# Altium project Workshop_Project.PrjPcb
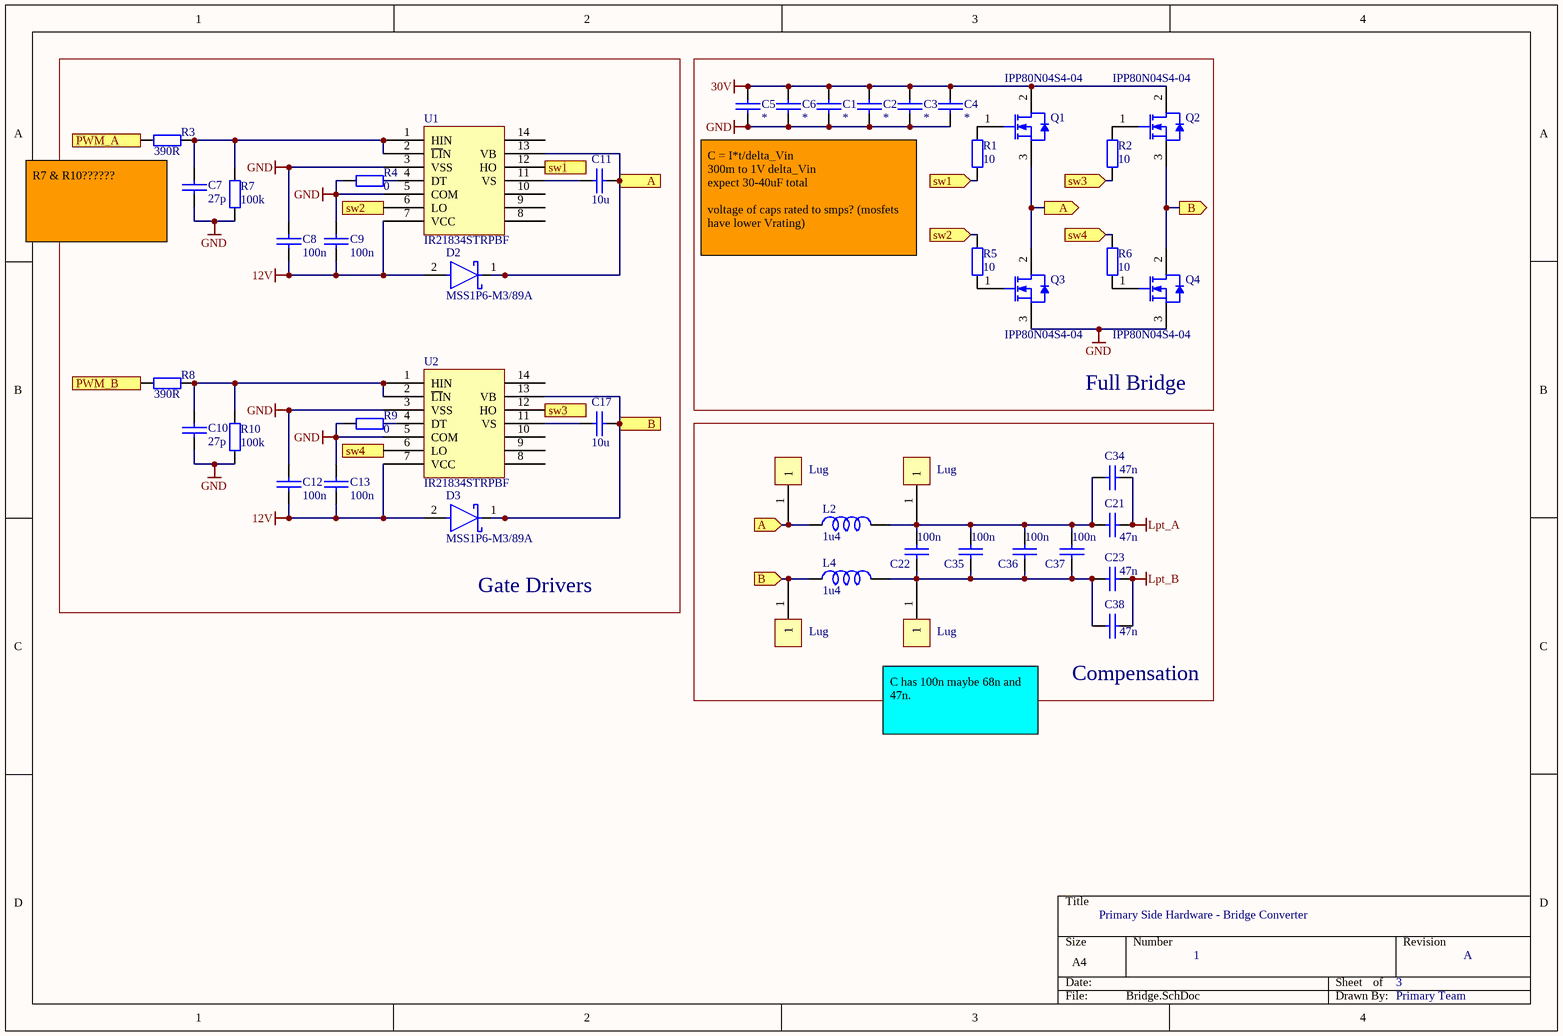
[diagram p0: Bridge.SchDoc]
HEllo: 5
3 sheets, 106 parts. Net scope: flat (ports and power ports of the same name join across sheets).
Board file: PCB.PcbDoc
Sheets:
  Bridge.SchDoc
  Control.SchDoc
  Misc.SchDoc

## Sheet Bridge.SchDoc: Primary Side Hardware - Bridge Converter
size A4; Author: Suzanne Lo; Revision: A; SheetNumber: 1; SheetTotal: 3

### Parts
C1  *  [C1210]
C2  *  [C1210]
C3  *  [C1210]
C4  *  [C1210]
C5  *  [C1210]
C6  *  [C1210]
C7  27p  [C0805]
C8  100n  [C1210]
C9  100n  [C1210]
C10  27p  [C0805]
C11  10u  [C1210]
C12  100n  [C1210]
C13  100n  [C1210]
C17  10u  [C1210]
C21  47n  [C5750]
C22  100n  [C5750]
C23  47n  [C5750]
C34  47n  [C5750]
C35  100n  [C5750]
C36  100n  [C5750]
C37  100n  [C5750]
C38  47n  [C5750]
D2  MSS1P6-M3/89A  [FP-96591-MFG]
D3  MSS1P6-M3/89A  [FP-96591-MFG]
L2  1u4  [EFD20]
L4  1u4  [EFD20]
P6  Lug  [M3 Lug]
P7  Lug  [M3 Lug]
P8  Lug  [M3 Lug]
P9  Lug  [M3 Lug]
Q1  IPP80N04S4-04  [INF-PG-TO220-3-1]
Q2  IPP80N04S4-04  [INF-PG-TO220-3-1]
Q3  IPP80N04S4-04  [INF-PG-TO220-3-1]
Q4  IPP80N04S4-04  [INF-PG-TO220-3-1]
R1  10  [R1206]
R2  10  [R1206]
R3  390R  [R0805]
R4  0  [R0805]
R5  10  [R1206]
R6  10  [R1206]
R7  100k  [R0805]
R8  390R  [R0805]
R9  0  [R0805]
R10  100k  [R0805]
U1  IR21834STRPBF  [SOIC127P600X175-14N]
U2  IR21834STRPBF  [SOIC127P600X175-14N]

### Blocks framed on the sheet
Gate Drivers: C7-C13 C17 D2 D3 R3 R4 R7-R10 U1 U2
Full Bridge: C1-C6 Q1-Q4 R1 R2 R5 R6
Compensation: C21-C23 C34-C38 L2 L4 P6-P9

### Ports
A (in), A (out), B (in), B (out), PWM_A (in), PWM_B (in), sw1 (in), sw1 (out), sw2 (in), sw2 (out), sw3 (in), sw3 (out), sw4 (in), sw4 (out)

### Nets
12V: C8.2 C9.2 C12.2 C13.2 D2.2(A) D3.2(A) U1.7(VCC) U2.7(VCC)
30V: C1.1 C2.1 C3.1 C4.2 C5.1 C6.1 Q1.2(DRAIN) Q2.2(DRAIN)
GND: C1.2 C2.2 C3.2 C4.1 C5.2 C6.2 C7.2 C8.1 C9.1 C10.2 C12.1 C13.1 Q3.3(SOURCE) Q4.3(SOURCE) R4.2 R7.1 R9.1 R10.1 U1.3(VSS) U1.5(COM) U2.3(VSS) U2.5(COM)
Lpt_A: C21.2 C34.2
Lpt_B: C23.2 C38.2
A: C11.1 D2.1(C) L2.1 P6.1 Q1.3(SOURCE) Q3.2(DRAIN) U1.13(VB) ; port A
B: C17.1 D3.1(C) L4.1 P8.1 Q2.3(SOURCE) Q4.2(DRAIN) U2.13(VB) ; port B
PWM_A: R3.1 ; port PWM_A
PWM_B: R8.1 ; port PWM_B
sw1: R1.1 U1.12(HO) ; port sw1
sw2: R5.2 U1.6(LO) ; port sw2
sw3: R2.1 U2.12(HO) ; port sw3
sw4: R6.2 U2.6(LO) ; port sw4
NetC7_1: C7.1 R3.2 R7.2 U1.1(HIN) U1.2(~{LI}N)
NetC10_1: C10.1 R8.2 R10.2 U2.1(HIN) U2.2(~{LI}N)
NetC11_2: C11.2 U1.11(VS)
NetC17_2: C17.2 U2.11(VS)
NetC21_1: C21.1 C22.2 C34.1 C35.2 C36.2 C37.2 L2.2 P7.1
NetC22_1: C22.1 C23.1 C35.1 C36.1 C37.1 C38.1 L4.2 P9.1
NetQ1_1: Q1.1(GATE) R1.2
NetQ2_1: Q2.1(GATE) R2.2
NetQ3_1: Q3.1(GATE) R5.1
NetQ4_1: Q4.1(GATE) R6.1
NetR4_1: R4.1 U1.4(DT)
NetR9_2: R9.2 U2.4(DT)

Not connected (* = marked no-connect by the designer): U1 8 9 10 14; U2 8 9 10 14

### Notes on the sheet
- R7 & R10??????
- C = I*t/delta_Vin
  300m to 1V delta_Vin
  expect 30-40uF total
  voltage of caps rated to smps? (mosfets have lower Vrating)
- (near P9) C has 100n maybe 68n and 47n.
- Primary Team

### Library data of the parts
C1-C13 C17 C21-C23 C34-C38 = CerCap_SMT: SMT ceramic capacitor selectable size
  C1-C6: Value: *
  C7 C10: Value: 27p
  C8 C9 C12 C13 C22 C35-C37: Value: 100n
  C11 C17: Value: 10u
  C21 C23 C34 C38: Value: 47n
D2 D3 = MSS1P6-M3/89A: DIODE SCHOTTKY 60V 1A MICROSMP; Manufacturer: Vishay; Max Junction Temp: +150°C; Peak Reverse Current: 20uA; Max Surge Forward Current: 25A; Capacitance: 40pF; Value: 40pF; Temperature Range Low: -55°C; Automotive: No; Manufacturer Part Number: MSS1P6-M3/89A; ComponentLink2Description: Datasheet; RoHS: TRUE; Temperature Range High: +150°C; Forward Current: 1A; Height: 0.73mm; Max Repetitive Reverse Voltage: 60V; Device Class L2: Diodes; Octopart: https://octopart.com/mss1p6-m3%2F89a-vishay-42763284; Digikey Description: DIODE SCHOTTKY 60V 1A MICROSMP; Device Class L1: Discrete Semiconductors; Package: 96591; ComponentLink2URL: http://www.vishay.com/docs/89018/mss1p6.pdf; Category: Diode; Temperature: -55°C to +150°C; Footprint Url: http://www.vishay.com/docs/96591/microsmp_do-219ad_fredpt.pdf; Mouser Description: Schottky Diodes & Rectifiers 1.0 Amp 60 Volt; Device Class L3: Schottky Diodes; Lead Free: Yes
L2 L4 = L: Value: 1u4
Q1-Q4 = IPP80N04S4-04: OptiMOS-T2 Power-Transistor, 40 V VDS, 80 A ID, PG-TO220-3-1, Tube, Green; Manufacturer: Infineon; VDS (max): 40 V; RDS (on) (max) (@10V): 4.6 mOhm; Ptot (max): 71 W; IDpuls (max): 320 A; Green: TRUE; VGS(th) (max): 4 V; QG: 33 nC; RthJC (max): 2.1 K/W; ID (max): 80 A; VGS(th) (min): 2 V; PartNumber: IPP80N04S4-04; ComponentLink2Description: Datasheet; DatasheetVersion: Rev. 1.0; Halogen-free: TRUE; ComponentLink3Description: Package Specification; PackageDescription: 3-Pin Plastic (Green) Transistor Single Outline Package, 10 x 9.25 mm Body, 2.54 mm Pitch; ComponentLink3URL: http://www.infineon.com/dgdl/BTS117_DS_14.pdf?folderId=db3a30431400ef68011421b54e2e0564&fileId=db3a30433a747525013abff8302d549c&location=en.Products.Automotive_ICs.Smart_High-_and_Low-Side_Switches.HITFET___TEMPFET__-_Smart_Low-Side_Switches.DATASHEET.BTS1; PackageReference: PG-TO220-3-1; PackageVersion: Jul-12; Packing: Tube; ComponentLink1Description: Manufacturer URL; ComponentLink2URL: http://www.infineon.com/dgdl/IPP_B_I80N04S4-04_DS_1_0.pdf?folderId=db3a304412b407950112b42b75b74520&fileId=db3a304328c6bd5c01291c71d4085dfa&location=en.Products.Automotive_ICs.Automotive_MOSFETs.Single__N-Channel_40V_MOSFETs.DATASHEET.IPP_B_I80N04S4-04_DS_; Mounting Technology: Through Hole; ComponentLink1URL: http://www.infineon.com/; Technology: OptiMOS-T2
R1-R10 = Res_SMT: 0805 or 1206 resistor; Published: 8-Jun-2000; LatestRevisionDate: 17-Jul-2002; LatestRevisionNote: Re-released for DXP Platform.; PackageReference: AXIAL-0.4; Publisher: Altium Limited; ComponentLink1Description: https://nz.mouser.com/datasheet/2/315/AOA0000C304-1149620.pdf
  R1 R2 R5 R6: Value: 10
  R3 R8: Value: 390R
  R4 R9: Value: 0
  R7 R10: Value: 100k
U1 U2 = IR21834STRPBF: 600 V half-bridge gate driver IC with programmable deadtime, SOIC 14N, RoHS; Manufacturer: International Rectifier; Number of Outputs: 2; Max Supply Voltage: 20V; Min Supply Voltage: 10V; Max Power Dissipation: 1W; Turn-On Delay Time: 35ns; Max Supply Current: 1.6mA; Rise Time: 60ns; Output Current: 1.9A; Nominal Supply Current: 1mA; Propagation Delay: 330ns; Max Output Current: 2.3A; Supplier 1: Newark; Manufacturer Part Number: IR21834STRPBF; RoHS: Yes; Category: Gate Drivers; Mount: Surface Mount; Case/Package: SOIC; Number of Pins: 14; Min Operating Temperature: -40°C; Max Operating Temperature: 125°C; Packaging: Tape and Reel; Package Quantity: 1; Series: -; Output Voltage: 20V; Number of Drivers: 2; Fall Time: 35ns; Turn-Off Delay Time: 35ns; Power Dissipation: 1W; Length: 8.74mm; Width: 3.99mm; Height: 1.5mm; REACH SVHC: No SVHC; RoHS Compliant: Yes; ComponentLink1URL: https://datasheet.ciiva.com/26878/ir21834strpbf-26878870.pdf?src-supplier=IIIC; ComponentLink1Description: https://datasheet.ciiva.com/26878/ir21834strpbf-26878870.pdf?src-supplier=IIIC; ComponentLink2URL: https://datasheet.ciiva.com/8068/ir2183-8068250.pdf?src-supplier=Element14; ComponentLink2Description: https://datasheet.ciiva.com/8068/ir2183-8068250.pdf?src-supplier=Element14; ComponentLink3URL: https://datasheet.ciiva.com/1950/ir2183-1950222.pdf?src-supplier=Digi-Key; ComponentLink3Description: https://datasheet.ciiva.com/1950/ir2183-1950222.pdf?src-supplier=Digi-Key; ComponentLink4URL: https://datasheet.ciiva.com/1950/ir2183-1950223.pdf?src-supplier=Digi-Key; ComponentLink4Description: https://datasheet.ciiva.com/1950/ir2183-1950223.pdf?src-supplier=Digi-Key; ComponentLink5URL: https://datasheet.ciiva.com/1950/ir2183-1950221.pdf?src-supplier=Digi-Key; ComponentLink5Description: https://datasheet.ciiva.com/1950/ir2183-1950221.pdf?src-supplier=Digi-Key; ComponentLink6URL: https://datasheet.ciiva.com/16287/ir2183-16287545.pdf?src-supplier=Future+Electronics; ComponentLink6Description: https://datasheet.ciiva.com/16287/ir2183-16287545.pdf?src-supplier=Future+Electronics

## Sheet Control.SchDoc: Primary Side Hardware - Control
size A4; Author: Primary Team; Revision: A; SheetNumber: 2; SheetTotal: 3
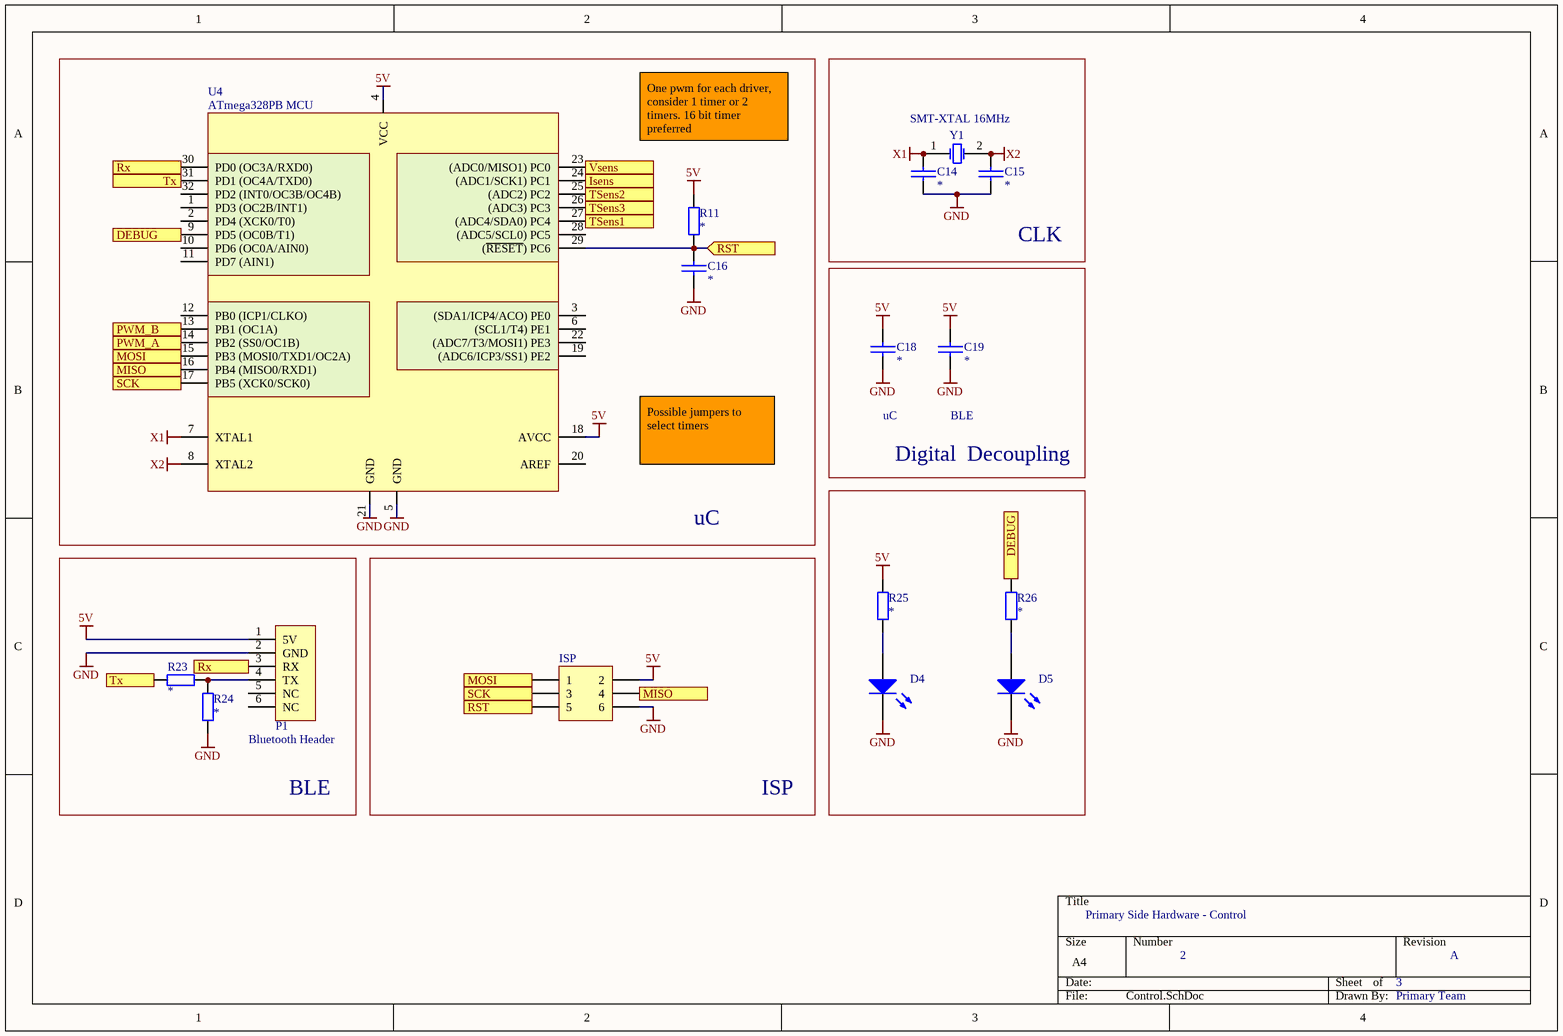
[diagram p1: Control.SchDoc]

### Parts
C14  *  [C0805]
C15  *  [C0805]
C16  *  [C0805]
C18  *  [C0805]
C19  *  [C0805]
D4  LTST-C170KGKT  [0805 LED]  (value not drawn)
D5  LTST-C170KGKT  [0805 LED]  (value not drawn)
ISP  P2  [HDR2X3]  (value not drawn)
P1  BLE Module Header  [HM10_HDR1X6]  (value not drawn)
R11  *  [R0805]
R23  *  [R0805]
R24  *  [R0805]
R25  *  [R0805]
R26  *  [R0805]
U4  ATmega328PB MCU  [32 - TQFP]
Y1  SMT-XTAL 16MHz  [HC49-US]

### Blocks framed on the sheet
uC: C16 R11 U4
CLK: C14 C15 Y1
BLE: P1 R23 R24
ISP: ISP

### Ports
DEBUG (in), DEBUG (out), Isens (in), MISO (in), MISO (out), MOSI (in), MOSI (out), PWM_A (out), PWM_B (out), RST (in), RST (out), Rx (in), Rx (out), SCK (in), SCK (out), TSens1 (in), TSens2 (in), TSens3 (in), Tx (in), Tx (out), Vsens (in)

### Nets
5V: C18.1 C19.1 ISP.2 P1.1(5V) R11.2 R25.2 U4.4(VCC) U4.18(AVCC)
GND: C14.2 C15.2 C16.2 C18.2 C19.2 D4.2(K) D5.2(K) ISP.6 P1.2(GND) R24.1 U4.5(GND) U4.21(GND)
X1: C14.1 U4.7(XTAL1) Y1.1(OSC1)
X2: C15.1 U4.8(XTAL2) Y1.2(OSC2)
DEBUG: R26.2 U4.9(PD5_(OC0B/T1)) ; port DEBUG
Isens: U4.24((ADC1/SCK1)_PC1) ; port Isens
MISO: ISP.4 U4.16(PB4_(MISO0/RXD1)) ; port MISO
MOSI: ISP.1 U4.15(PB3_(MOSI0/TXD1/OC2A)) ; port MOSI
PWM_A: U4.14(PB2_(SS0/OC1B)) ; port PWM_A
PWM_B: U4.13(PB1_(OC1A)) ; port PWM_B
RST: C16.1 ISP.5 R11.1 U4.29((~{RESET})_PC6) ; port RST
Rx: P1.3(RX) U4.30(PD0_(OC3A/RXD0)) ; port Rx
SCK: ISP.3 U4.17(PB5_(XCK0/SCK0)) ; port SCK
TSens1: U4.27((ADC4/SDA0)_PC4) ; port TSens1
TSens2: U4.25((ADC2)_PC2) ; port TSens2
TSens3: U4.26((ADC3)_PC3) ; port TSens3
Tx: R23.1 U4.31(PD1_(OC4A/TXD0)) ; port Tx
Vsens: U4.23((ADC0/MISO1)_PC0) ; port Vsens
NetD4_1: D4.1(A) R25.1
NetD5_1: D5.1(A) R26.1
NetP1_4: P1.4(TX) R23.2 R24.2

Not connected (* = marked no-connect by the designer): P1 5(NC) 6(NC); U4 1(PD3_(OC2B/INT1)) 2(PD4_(XCK0/T0)) 3((SDA1/ICP4/ACO)_PE0) 6((SCL1/T4)_PE1) 10(PD6_(OC0A/AIN0)) 11(PD7_(AIN1)) 12(PB0_(ICP1/CLKO)) 19((ADC6/ICP3/SS1)_PE2) 20(AREF) 22((ADC7/T3/MOSI1)_PE3) 28((ADC5/SCL0)_PC5) 32(PD2_(INT0/OC3B/OC4B))

### Notes on the sheet
- One pwm for each driver, consider 1 timer or 2 timers. 16 bit timer preferred
- uC
- BLE
- Possible jumpers to select timers
- Digital  Decoupling
- Bluetooth Header
- Primary Team

### Library data of the parts
C14-C16 C18 C19 = CerCap_SMT: SMT ceramic capacitor selectable size; Value: *
D4 D5 = LED_SMT_0805: SMT LED 0805 size; Manufacturer: Lite-On Inc.; Color: Green; Lens Color: Colorless; Lens Transparency: Clear; Millicandela Rating: 35mcd; Lens Style/Size: Rectangle with Flat Top, 1.40mm x 1.25mm; Voltage - Forward (Vf) (Typ): 2V; Current - Test: 20mA; Viewing Angle: 130°; Wavelength - Dominant: 571nm; Wavelength - Peak: 574nm; Supplier 1: Digi-Key; Manufacturer Part Number: LTST-C170KGKT; RoHS: RoHS Compliant; Category: Optoelectronics; Stock 1: 503069; Pricing 1: 1=0.62, 10=0.459, 25=0.338, 100=0.2415, 250=0.16416, 500=0.14486, 1000=0.11347 (NZD); Packaging: Cut Tape (CT); Part Status: Active; Mounting Type: Surface Mount; Features: -; Package / Case: 0805 (2012 Metric); Size / Dimension: 2.00mm L x 1.25mm W; Height (Max): 1.10mm; ComponentLink1URL: http://optoelectronics.liteon.com/upload/download/DS22-2000-073/LTST-C170KGKT.pdf; ComponentLink1Description: http://optoelectronics.liteon.com/upload/download/DS22-2000-073/LTST-C170KGKT.pdf; Supplier Part Number 1: 160-1414-1-ND
ISP = Header 3X2: Header, 3-Pin, Dual row; LatestRevisionDate: 17-Jul-2002; LatestRevisionNote: Re-released for DXP Platform.; Publisher: Altium Limited
P1 = BLEModule_TH: 2.54mm pitch 6-pin header for BLE module; LatestRevisionDate: 17-Jul-2002; LatestRevisionNote: Re-released for DXP Platform.; Publisher: Altium Limited
R11 R23-R26 = Res_SMT: 0805 or 1206 resistor; Published: 8-Jun-2000; LatestRevisionDate: 17-Jul-2002; LatestRevisionNote: Re-released for DXP Platform.; PackageReference: AXIAL-0.4; Publisher: Altium Limited; Value: *; ComponentLink1Description: https://nz.mouser.com/datasheet/2/315/AOA0000C304-1149620.pdf
U4 = ATmega328PB_SMT_TQFP32: IC MCU 8BIT 32KB FLASH 32TQFP; Manufacturer: Atmel; Manufacturer Part Number: ATMEGA328PB-AN; Core Processor: AVR; Core Size: 8-Bit; Speed: 20MHz; Connectivity: I²C, SPI, UART/USART; Peripherals: Brown-out Detect/Reset, POR, PWM, WDT; Number of I/O: 27; Program Memory Size: 32KB (16K x 16); EEPROM Size: 1K x 8; RAM Size: 2K x 8; Voltage - Supply (Vcc/Vdd): 1.8 V ~ 5.5 V; Data Converters: A/D 8x10b; Oscillator Type: Internal; Supplier 1: Digi-Key; RoHS: RoHS Compliant; Category: Integrated Circuits (ICs); Stock 1: 366; Pricing 1: 1=2.74, 10=2.448, 25=2.2032, 100=2.0074, 250=1.81152, 500=1.62548, 1000=1.37088 (USD); Packaging: Tray; Part Status: Active; Program Memory Type: FLASH; Operating Temperature: -40°C ~ 105°C (TA); Package / Case: 32-TQFP; Supplier Device Package: 32-TQFP (7x7); ComponentLink1URL: http://www.atmel.com/images/atmel-42397-8-bit-avr-microcontroller-atmega328pb_datasheet.pdf; ComponentLink1Description: http://www.atmel.com/images/atmel-42397-8-bit-avr-microcontroller-atmega328pb_datasheet.pdf
Y1 = TXC9C-16_XTAL_SMT: 9C-16.000MAAJ-T crystal 16.0000MHZ 18PF SMD; Manufacturer: TXC CORPORATION; Frequency Stability: ±30ppm; Operating Mode: Fundamental; Supplier 1: Digi-Key; Manufacturer Part Number: 9C-16.000MAAJ-T; RoHS: RoHS Compliant; Category: Crystals, Oscillators, Resonators; Stock 1: 11514; Pricing 1: 1=0.75, 10=0.628, 50=0.5656, 100=0.5026, 500=0.47744 (NZD); Packaging: Cut Tape (CT); Part Status: Active; Type: MHz Crystal; Frequency Tolerance: ±30ppm; Load Capacitance: 18pF; Operating Temperature: -20°C ~ 70°C; Ratings: -; Mounting Type: Surface Mount; Package / Case: HC-49/US; Size / Dimension: 0.449" L x 0.189" W (11.40mm x 4.80mm); Height - Seated (Max): 0.161" (4.10mm); ComponentLink1URL: http://www.txccorp.com/download/products/quartz_crystals/2015TXC_9C_32.pdf; ComponentLink1Description: http://www.txccorp.com/download/products/quartz_crystals/2015TXC_9C_32.pdf; Supplier Part Number 1: 887-1059-1-ND

## Sheet Misc.SchDoc: Primary Side Hardware - Miscellaneous
size A4; Author: Primary Team; Revision: A; SheetNumber: 3; SheetTotal: 3
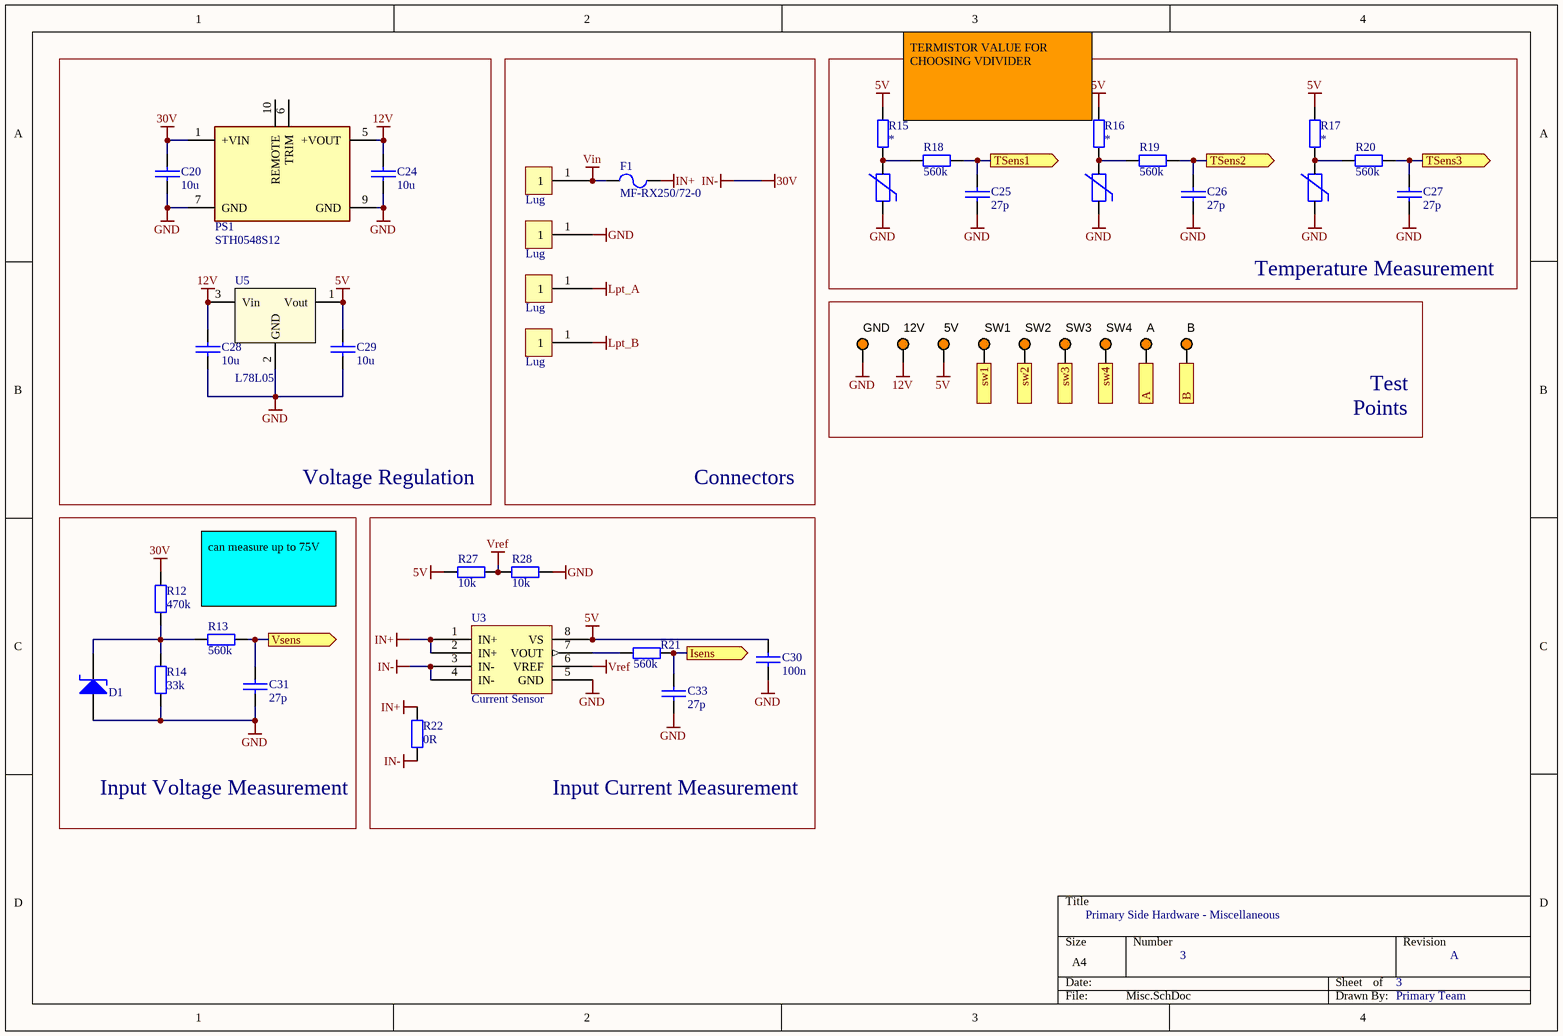
[diagram p2: Misc.SchDoc]

### Parts
5V  5003  [TP_TH]  (value not drawn)
12V  5003  [TP_TH]  (value not drawn)
A  5003  [TP_TH]  (value not drawn)
B  5003  [TP_TH]  (value not drawn)
C20  10u  [C1210]
C24  10u  [C1210]
C25  27p  [C0805]
C26  27p  [C0805]
C27  27p  [C0805]
C28  10u  [C1210]
C29  10u  [C1210]
C30  100n  [C0805]
C31  27p  [C0805]
C33  27p  [C0805]
D1  BZT52H-B5V1  [SOD123]  (value not drawn)
F1  MF-RX250/72-0  [TH_FUSE]
GND  5003  [TP_TH]  (value not drawn)
P2  Lug  [M3 Lug]
P3  Lug  [M4 Lug]
P4  Lug  [M4 Lug]
P5  Lug  [M3 Lug]
PS1  STH0548S12  [STH0548S12]
R12  470k  [R0805]
R13  560k  [R0805]
R14  33k  [R0805]
R15  *  [R0805]
R16  *  [R0805]
R17  *  [R0805]
R18  560k  [R0805]
R19  560k  [R0805]
R20  560k  [R0805]
R21  560k  [R0805]
R22  0R  [R0805]
R27  10k  [R0805]
R28  10k  [R0805]
SW1  5003  [TP_TH]  (value not drawn)
SW2  5003  [TP_TH]  (value not drawn)
SW3  5003  [TP_TH]  (value not drawn)
SW4  5003  [TP_TH]  (value not drawn)
T1  Thermistor  [LeadedThermistor]  (value not drawn)
T2  Thermistor  [LeadedThermistor]  (value not drawn)
T3  Thermistor  [LeadedThermistor]  (value not drawn)
U3  Current Sensor  [I-SOIC8]
U5  L78L05  [SOT-89]

### Blocks framed on the sheet
Voltage Regulation: C20 C24 C28 C29 PS1 U5
Connectors: F1 P2-P5
Temperature Measurement: C25-C27 R15-R20 T1-T3
Input Voltage Measurement: C31 D1 R12-R14
Input Current Measurement: C30 C33 R21 R22 R27 R28 U3

### Ports
A (out), B (out), Isens (out), sw1 (out), sw2 (out), sw3 (out), sw4 (out), TSens1 (out), TSens2 (out), TSens3 (out), Vsens (out)

### Nets
5V: 5V.1 C29.1 C30.1 R15.2 R16.2 R17.2 R27.1 U3.8(VS) U5.1(Vout)
12V: 12V.1 C24.1 C28.1 PS1.5(+VOUT) U5.3(Vin)
30V: C20.1 PS1.1(+VIN) R12.2 R22.2 U3.3(IN-) U3.4(IN-)  [also labelled IN-]
GND: C20.2 C24.2 C25.2 C26.2 C27.2 C28.2 C29.2 C30.2 C31.2 C33.2 D1.1(A) GND.1 P5.1 PS1.7(GND) PS1.9(GND) R14.1 R28.2 T1.1 T2.1 T3.1 U3.5(GND) U5.2(GND)
IN+: F1.2 R22.1 U3.1(IN+) U3.2(IN+)
Lpt_A: P3.1
Lpt_B: P4.1
Vin: F1.1 P2.1
Vref: R27.2 R28.1 U3.6(VREF)
A: A.1 ; port A
B: B.1 ; port B
Isens: C33.1 R21.1 ; port Isens
sw1: SW1.1 ; port sw1
sw2: SW2.1 ; port sw2
sw3: SW3.1 ; port sw3
sw4: SW4.1 ; port sw4
TSens1: C25.1 R18.1 ; port TSens1
TSens2: C26.1 R19.1 ; port TSens2
TSens3: C27.1 R20.1 ; port TSens3
Vsens: C31.1 R13.1 ; port Vsens
NetD1_2: D1.2(K) R12.1 R13.2 R14.2
NetR15_1: R15.1 R18.2 T1.2
NetR16_1: R16.1 R19.2 T2.2
NetR17_1: R17.1 R20.2 T3.2
NetR21_2: R21.2 U3.7(VOUT)

Not connected (* = marked no-connect by the designer): PS1 6(TRIM) 10(REMOTE)

### Notes on the sheet
- (near R16) TERMISTOR VALUE FOR CHOOSING VDIVIDER
- (near P4) Text
- Test Points
- can measure up to 75V
- Primary Team

### Library data of the parts
5V 12V A B GND SW1-SW4 = TestPoint: Test Point, Orange, 1-Pin THD, RoHS; Peak Reverse Current: 600 uA; Forward Current: 3 A; Max Surge Current: 80 A; Forward Voltage: 1.08 V; Max Operating Temperature: 150 degC; PackageReference: 5003; Pins: 2; ComponentLink2URL: http://keyelco.com/userAssets/file/M65p56.pdf; PackageDescription: 1-Pin Through Hole Device, Dia 2.54 mm; Weight: 0.01 lb; Diameter: 5.3 mm; Mount: Through Hole; Package Quantity: 500; Packaging: Bulk; Min Operating Temperature: -65 degC; ComponentLink1Description: Manufacturer URL; Height: 0.25 inch; ComponentLink1URL: http://www.keyelco.com/; ComponentLink2Description: Datasheet; Width: 0.25 inch; REACH SVHC: No SVHC; RoHSCompliant: true; Radiation Hardening: No; Length: 9.5 mm; DatasheetVersion: Jun-15
C20 C24-C31 C33 = CerCap_SMT: SMT ceramic capacitor selectable size
  C20 C24 C28 C29: Value: 10u
  C25-C27 C31 C33: Value: 27p
  C30: Value: 100n
D1 = Zener_SMT_SOD123: SMT zener diode with SOD123 package; Manufacturer: Nexperia USA Inc.; Manufacturer Part Number: BZT52H-B5V1,115; Tolerance: ±2%; RoHS: RoHS Compliant; Category: Discrete Semiconductor Products; Stock 1: 0; Pricing 1: 1=0.51, 10=0.408, 100=0.2164, 500=0.14232, 1000=0.09678 (NZD); Packaging: Cut Tape (CT); Part Status: Active; Operating Temperature: -65°C ~ 150°C (TA); Mounting Type: Surface Mount; Package / Case: SOD-123F; Supplier Device Package: SOD-123F; ComponentLink1URL: https://assets.nexperia.com/documents/data-sheet/BZT52H_SER.pdf; ComponentLink1Description: https://assets.nexperia.com/documents/data-sheet/BZT52H_SER.pdf; Supplier 1: Digi-Key
F1 = MF-RX250/72-0: PTC Resettable Fuse 2.5A(hold) 5A(trip) 72V 40A 2.5W 15.6s 0.05Ohm Radial 17.84 X 3.1 X 23.84mm Bulk; Manufacturer: Bourns; Number of Terminals/Pins: 2; Body Material: Polymer,Epoxy; Resistance: 80mR; Voltage Rating (AC): 60V; Lead Diameter: 0.81mm; Body Length: 17.84mm; Lead Length: 7.6mm; Body Diameter: 21.3mm; Approvals: UL; Supplier 1: Digi-Key; Manufacturer Part Number: MF-RX250/72-0; RoHS: Yes; Category: PTC Resettable Fuses; Stock 1: 206; Pricing 1: 1=0.60000, 5=0.58400, 10=0.56700, 50=0.47700, 100=0.39600, 250=0.36000, 500=0.30600, 1000=0.27000, 5000=0.24300 (USD); Mount: Through Hole,PCB; Case/Package: Radial; Number of Pins: 2; Contact Plating: Tin; Min Operating Temperature: -40°C; Max Operating Temperature: 85°C; Max Current Rating: 40A; Hold Current: 2.5A; Trip Current: 5A; Power Dissipation: 2.5W; Packaging: Bulk; Package Quantity: 500; Termination: Radial; Series: MF-RX/72; Time to Trip: 15.6s; Operating Supply Voltage: 72V; Voltage Rating: 72V; Current Rating: 40A; Max Power Dissipation: 2.5W; Voltage Rating (DC): 72V; Length: 31.44mm; Width: 17.84mm; Height: 3.1mm; Lead Pitch: 10.2mm; Terminal Pitch: 10.2mm; Wire/Cable Diameter: 0.81mm; Body Height: 23.84mm; Thickness: 3.1mm; Radiation Hardening: No; RoHS Compliant: Yes; REACH SVHC: No SVHC; Lead Free: Lead Free; Flammability Rating: UL94 V-0; ComponentLink1URL: https://datasheet.ciiva.com/1274/1727898-1274752.pdf?src-supplier=Element14; ComponentLink1Description: https://datasheet.ciiva.com/1274/1727898-1274752.pdf?src-supplier=Element14; ComponentLink2URL: https://datasheet.ciiva.com/3019/mfrx72-3019851.pdf?src-supplier=Avnet; ComponentLink2Description: https://datasheet.ciiva.com/3019/mfrx72-3019851.pdf?src-supplier=Avnet; ComponentLink3URL: https://datasheet.ciiva.com/4501/mfrx72-4501292.pdf?src-supplier=Mouser; ComponentLink3Description: https://datasheet.ciiva.com/4501/mfrx72-4501292.pdf?src-supplier=Mouser; ComponentLink4URL: https://datasheet.ciiva.com/32425/mf-rx72-series-eng-tds-32425991.pdf?src-supplier=Distrelec; ComponentLink4Description: https://datasheet.ciiva.com/32425/mf-rx72-series-eng-tds-32425991.pdf?src-supplier=Distrelec; ComponentLink5URL: https://datasheet.ciiva.com/326/mfrx72-326639.pdf?src-supplier=Digi-Key; ComponentLink5Description: https://datasheet.ciiva.com/326/mfrx72-326639.pdf?src-supplier=Digi-Key; ComponentLink6URL: https://datasheet.ciiva.com/17401/mfrx72-17401583.pdf?src-supplier=Avnet+Europe; ComponentLink6Description: https://datasheet.ciiva.com/17401/mfrx72-17401583.pdf?src-supplier=Avnet+Europe; ComponentLink7URL: https://datasheet.ciiva.com/14539/70153449-14539563.pdf?src-supplier=Allied+Electronics; ComponentLink7Description: https://datasheet.ciiva.com/14539/70153449-14539563.pdf?src-supplier=Allied+Electronics; ComponentLink8URL: https://datasheet.ciiva.com/15187/getdatasheetpartid-298829-15187739.pdf?src-supplier=Verical; ComponentLink8Description: https://datasheet.ciiva.com/15187/getdatasheetpartid-298829-15187739.pdf?src-supplier=Verical; ComponentLink9URL: https://datasheet.ciiva.com/30097/669mfrx72-30097310.pdf?src-supplier=Onlinecomponents.com; ComponentLink9Description: https://datasheet.ciiva.com/30097/669mfrx72-30097310.pdf?src-supplier=Onlinecomponents.com
PS1 = STH0548S12: Power Supply; Manufacturer_Name: XP POWER; Manufacturer_Part_Number: STH0548S15; Datasheet Link: https://4donline.ihs.com/images/VipMasterIC/IC/XPPO/XPPO-S-A0009456324/XPPO-S-A0009456324-1.pdf?hkey=EF798316E3902B6ED9A73243A3159BB0; Height: 5.5mm
R12-R22 = Res_SMT: 0805 or 1206 resistor; Published: 8-Jun-2000; LatestRevisionDate: 17-Jul-2002; LatestRevisionNote: Re-released for DXP Platform.; PackageReference: AXIAL-0.4; Publisher: Altium Limited; ComponentLink1Description: https://nz.mouser.com/datasheet/2/315/AOA0000C304-1149620.pdf
  R12: Value: 470k
  R13 R18-R21: Value: 560k
  R14: Value: 33k
  R15-R17: Value: *
  R22: Value: 0R
R27 R28 = Res_SMT: Resistor 0805 or 1206; Published: 8-Jun-2000; LatestRevisionDate: 17-Jul-2002; LatestRevisionNote: Re-released for DXP Platform.; PackageReference: AXIAL-0.4; Publisher: Altium Limited; Value: 10k; ComponentLink1Description: https://nz.mouser.com/datasheet/2/315/AOA0000C304-1149620.pdf
U3 = Current Sensor: TMCS1100; ComponentLink1Description: New link; ComponentLink1URL: https://www.ti.com/lit/ds/symlink/tmcs1100.pdf?ts=1642385371674&ref_url=https%253A%252F%252Fnz.mouser.com%252F
U5 = L78L05_SMT_SOT89: LDO Voltage Regulator 5V; ComponentLink1URL: http://www.st.com/content/ccc/resource/technical/document/datasheet/99/3b/7d/91/91/51/4b/be/CD00000544.pdf/files/CD00000544.pdf/jcr:content/translations/en.CD00000544.pdf; ComponentLink1Description: http://www.st.com/content/ccc/resource/technical/document/datasheet/99/3b/7d/91/91/51/4b/be/CD00000544.pdf/files/CD00000544.pdf/jcr:content/translations/en.CD00000544.pdf; Supplier 1: Digi-Key; Supplier Part Number 1: 497-1181-1-ND

## Nets that join several sheets
5V: Control (8 pins), Misc (9 pins)
12V: Bridge (8 pins), Misc (5 pins)
30V: Bridge (8 pins), Misc (6 pins)
GND: Bridge (22 pins), Control (12 pins), Misc (22 pins)
Lpt_A: Bridge (C21.2 C34.2), Misc (P3.1)
Lpt_B: Bridge (C23.2 C38.2), Misc (P4.1)
A: Bridge (7 pins), Misc (A.1)
B: Bridge (7 pins), Misc (B.1)
Isens: Control (U4.24), Misc (C33.1 R21.1)
PWM_A: Bridge (R3.1), Control (U4.14)
PWM_B: Bridge (R8.1), Control (U4.13)
sw1: Bridge (R1.1 U1.12), Misc (SW1.1)
sw2: Bridge (R5.2 U1.6), Misc (SW2.1)
sw3: Bridge (R2.1 U2.12), Misc (SW3.1)
sw4: Bridge (R6.2 U2.6), Misc (SW4.1)
TSens1: Control (U4.27), Misc (C25.1 R18.1)
TSens2: Control (U4.25), Misc (C26.1 R19.1)
TSens3: Control (U4.26), Misc (C27.1 R20.1)
Vsens: Control (U4.23), Misc (C31.1 R13.1)